# EAGLE design simpleSchematicWithParts (EAGLE 7.4.0)
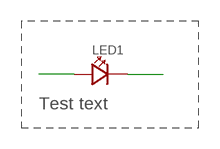
[diagram p0: schematic, sheet 1]

## Parts
LED1  LED5MM  [LED-5MM]

## Nets
N$1: LED1.A
N$2: LED1.K(C)

## Notes on the sheet
- Test text

## Library data of the parts
LED1 = p.peter-leds:LED

## Board
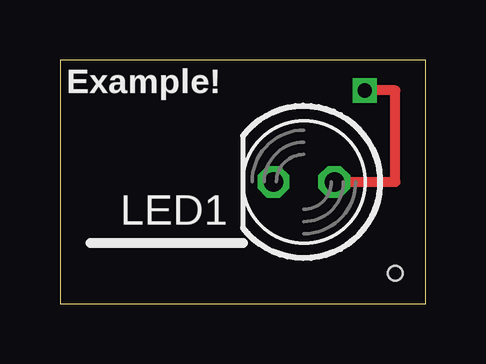
[diagram p1: board, top side]
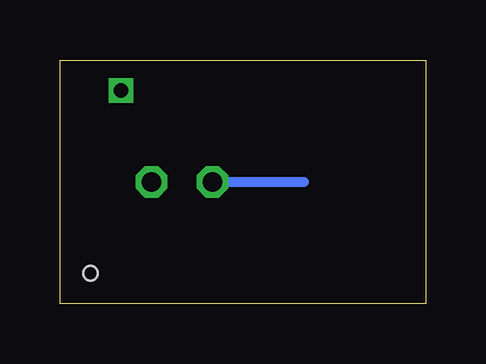
[diagram p2: board, bottom side, seen from below]

Size 15.24 x 10.16 mm. Coordinates in mm from the lower left corner, seen from the top.
Outline: 0,0 15.24,0 15.24,10.16 0,10.16 0,0
Copper layers (1*16): Top 0.035mm / dielectric 1.5mm / Bottom 0.035mm
Design rules "default": minimum track width 10mil, minimum drill 24mil, track to track 8mil, track to pad 8mil, pad to pad 8mil, via to via 8mil, smd to smd 8mil, copper to edge 40mil, drill to drill 8mil, minimum pad ring 10mil, minimum via ring 8mil, stop-mask expansion 4mil, vias tented up to drill 0mil, thermal gap 10mil
Holes 0.6 mm at 13.97,1.27

### Footprints (pad centres in the part's own frame; a part is rotated, then mirrored left to right if it is on the bottom)
LED-5MM = drill 0.813 octagon: A -1.27,0; K 1.27,0

### Placement (x,y rotation side)
LED1  10.16,5.08 180 top

### Tracks (layer width: path | path; a pad name or v marks a point on that pad's centre or on a via)
N$1  (via drill 0.6)
  Top 0.406: LED1.A 13.97,5.08 13.97,8.89 v12.7,8.89
N$2
  Bottom 0.406: LED1.K 5.08,5.08

### Text on the board
tPlace: Example!